# EAGLE schematic ESC2 (EAGLE 9.6.2)
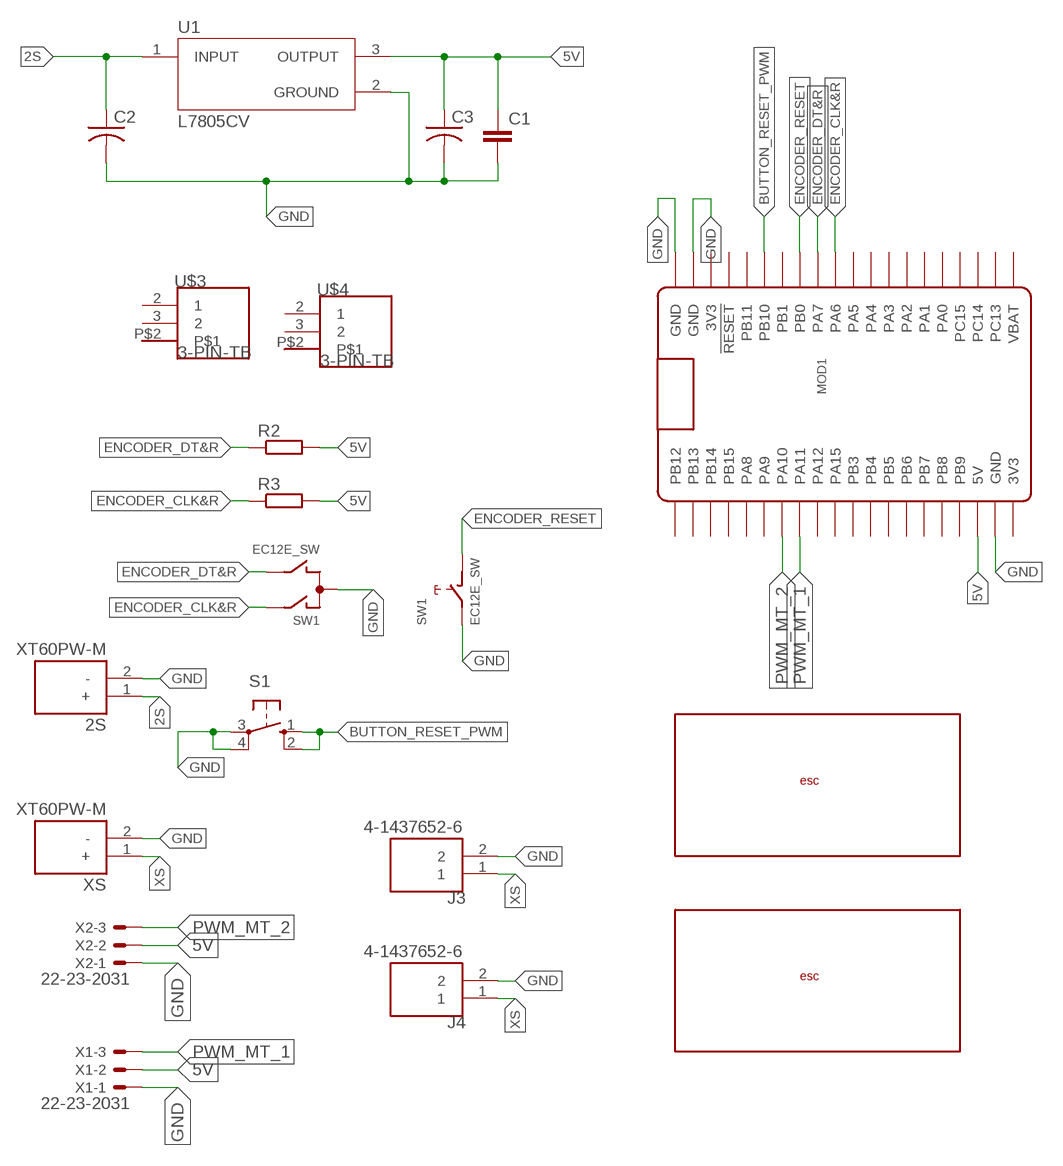
[diagram p0: schematic, sheet 1]

## Parts
2S  XT60PW-M  [AMASS_XT60PW-M]
C1  C-EUC1206  [C1206]
C2  C-USC1206  [C1206]
C3  C-USC1206  [C1206]
J3  4-1437652-6  [TE_4-1437652-6]
J4  4-1437652-6  [TE_4-1437652-6]
MOD1  BLUE_PILL  [BLUE_PILL]
R2  R-EU_R1206  [R1206]
R3  R-EU_R1206  [R1206]
S1  10-XX  [B3F-10XX]
SW1  EC12E_SW  [ALPS_EC12E_SW]
U1  L7805CV  [TO255P1040X460X1968-3]
U$1  ESC_LIB  [ESC]
U$2  ESC_LIB  [ESC]
U$3  3-PIN-TB  [3-PIN-TB]
U$4  3-PIN-TB  [3-PIN-TB]
X1  22-23-2031  [22-23-2031]
X2  22-23-2031  [22-23-2031]
XS  XT60PW-M  [AMASS_XT60PW-M]

## Nets
2S: 2S.1(+) C2.1 U1.1(INPUT)
5V: C1.1 C3.1 MOD1.P$18(5V) R2.2 R3.2 U1.3(OUTPUT) X1.2 X2.2
BUTTON_RESET_PWM: MOD1.P$26(PB10) S1.1(S) S1.2(S1)
ENCODER_CLK&R: MOD1.P$30(PA6) R3.1 SW1.A
ENCODER_DT&R: MOD1.P$29(PA7) R2.1 SW1.B
ENCODER_RESET: MOD1.P$28(PB0) SW1.D
GND: 2S.2(-) C1.2 C2.2 C3.2 J3.2 J4.2 MOD1.P$19(GND) MOD1.P$21(GND) MOD1.P$22(GND) S1.3(P) S1.4(P1) SW1.C SW1.E U1.2(GROUND) X1.1 X2.1 XS.2(-)
PWM_MT_1: MOD1.P$8(PA11) X1.3
PWM_MT_2: MOD1.P$7(PA10) X2.3
XS: J3.1 J4.1 XS.1(+)
Unconnected: MOD1.P$1(PB12) MOD1.P$2(PB13) MOD1.P$3(PB14) MOD1.P$4(PB15) MOD1.P$5(PA8) MOD1.P$6(PA9) MOD1.P$9(PA12) MOD1.P$10(PA15) MOD1.P$11(PB3) MOD1.P$12(PB4) MOD1.P$13(PB5) MOD1.P$14(PB6) MOD1.P$15(PB7) MOD1.P$16(PB8) MOD1.P$17(PB9) MOD1.P$20(3V3) MOD1.P$23(3V3) MOD1.P$24(!RESET) MOD1.P$25(PB11) MOD1.P$27(PB1) MOD1.P$31(PA5) MOD1.P$32(PA4) MOD1.P$33(PA3) MOD1.P$34(PA2) MOD1.P$35(PA1) MOD1.P$36(PA0) MOD1.P$37(PC15) MOD1.P$38(PC14) MOD1.P$39(PC13) MOD1.P$40(VBAT) SW1.GND1(G) SW1.GND2(G) U$3.2 U$3.3 U$3.P$2 U$4.2 U$4.3 U$4.P$2

## Library data of the parts
2S XS = XT60PW-M:XT60PW-M: Check availability <https://pricing.snapeda.com/parts/XT60PW-M/AMASS/view-part?ref=eda>; AVAILABILITY: Not in stock; CHECK_PRICES: https://www.snapeda.com/parts/XT60PW-M/AMASS/view-part/?ref=eda; DESCRIPTION: Socket, DC supply, male, PIN: 2; MF: AMASS; MP: XT60PW-M; PACKAGE: Package; PRICE: None; SNAPEDA_LINK: https://www.snapeda.com/parts/XT60PW-M/AMASS/view-part/?ref=snap
C1 = rcl:C-EU: CAPACITOR, European symbol; SPICEPREFIX: C
C2 C3 = rcl:C-US: CAPACITOR, American symbol; SPICEPREFIX: C
J3 J4 = Terminal-Block-4-1437652-6:4-1437652-6: Check availability <https://pricing.snapeda.com/parts/4-1437652-6/TE%20Connectivity%20/%20AMP/view-part?ref=eda>; AVAILABILITY: In Stock; CHECK_PRICES: https://www.snapeda.com/parts/4-1437652-6/TE+Connectivity+%252F+AMP/view-part/?ref=eda; COMMENT: 4-1437652-6; DESCRIPTION: Conn Terminal Block 2 POS 9.53mm Solder ST Thru-Hole 25A/Contact; EU_ROHS_COMPLIANCE: Compliant; MF: TE Connectivity / AMP; MP: 4-1437652-6; PACKAGE: None; PRICE: None; PURCHASE-URL: https://www.snapeda.com/api/url_track_click_mouser/?unipart_id=2382815&manufacturer=TE Connectivity / AMP&part_name=4-1437652-6&search_term=terminal block 9.53mm; SNAPEDA_LINK: https://www.snapeda.com/parts/4-1437652-6/TE+Connectivity+%252F+AMP/view-part/?ref=snap
MOD1 = BluePill:BLUE_PILL
R2 R3 = rcl:R-EU_: RESISTOR, European symbol; SPICEPREFIX: R
S1 = switch-omron:10-XX: OMRON SWITCH; MPN: B3F-1000; OC_FARNELL: 176432; OC_NEWARK: 36M3542
SW1 = switch-alps:EC12E_SW: ALPS rotary Encoder EC12E series with switch; MPN: EC12E2424407; OC_FARNELL: 1520813; OC_NEWARK: 74M1068
U1 = L7805CV:L7805CV: Standard Regulator Pos 5V 1.5A 3-Pin(3+Tab) TO-220 Standard Regulator Pos 5V 1.5A 3-Pin(3+Tab) TO-220 Check availability <https://pricing.snapeda.com/parts/L7805CV/STMicroelectronics/view-part?ref=eda>; AVAILABILITY: In Stock; CHECK_PRICES: https://www.snapeda.com/parts/L7805CV/STMicroelectronics/view-part/?ref=eda; DESCRIPTION: Linear Voltage Regulator IC Positive Fixed 1 Output 1.5A TO-220; MF: STMicroelectronics; MP: L7805CV; PACKAGE: TO-220-3 STMicroelectronics; PRICE: None; PURCHASE-URL: https://www.snapeda.com/api/url_track_click_mouser/?unipart_id=501150&manufacturer=STMicroelectronics&part_name=L7805CV&search_term=l7805; SNAPEDA_LINK: https://www.snapeda.com/parts/L7805CV/STMicroelectronics/view-part/?ref=snap
U$1 U$2 = ESC:ESC_LIB
U$3 U$4 = Terminal-Block-4-1437652-6:3-PIN-TB
X1 X2 = con-molex:22-23-2031: .100" (2.54mm) Center Header - 3 Pin; MF: MOLEX; MPN: 22-23-2031; OC_FARNELL: 1462950; OC_NEWARK: 30C0862